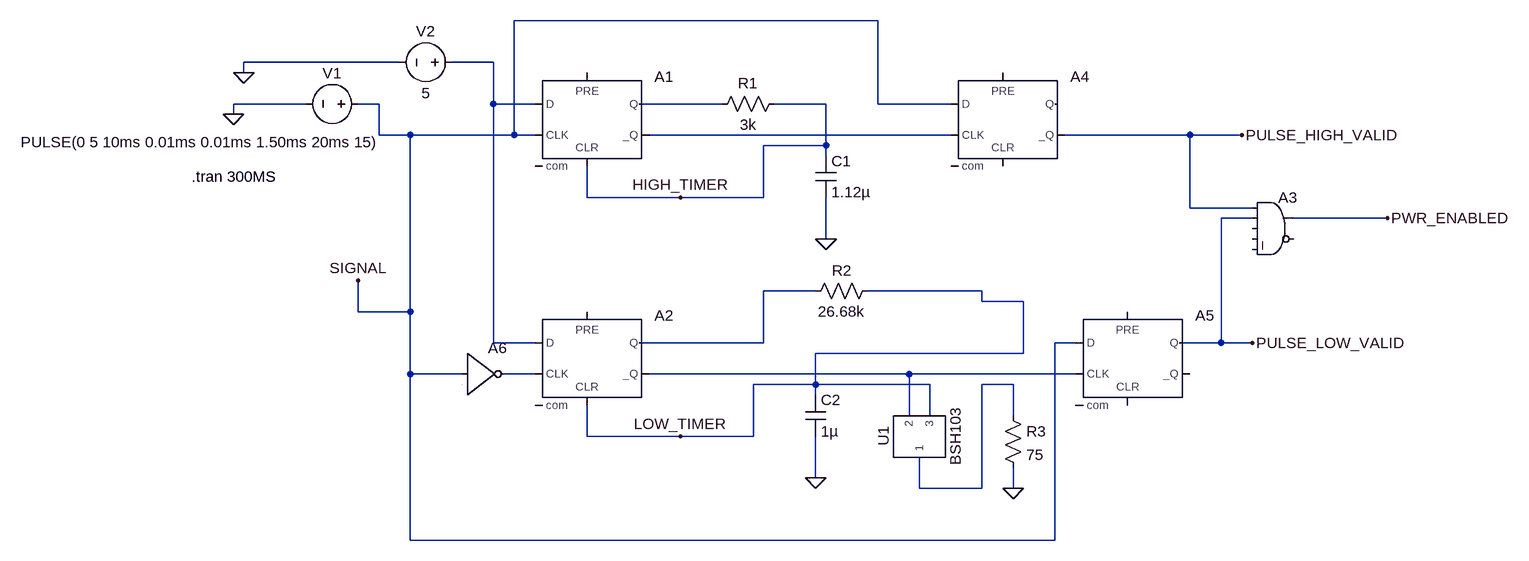
[diagram p0: schematic KillSwitch2.asc]
KillSwitch2.asc, the LTspice schematic file:
Version 4
SHEET 1 1240 956
WIRE 256 32 -304 32
WIRE -480 96 -720 96
WIRE -336 96 -400 96
WIRE -720 112 -720 96
WIRE -624 160 -736 160
WIRE -512 160 -544 160
WIRE -336 160 -336 96
WIRE -272 160 -336 160
WIRE 16 160 -112 160
WIRE 176 160 96 160
WIRE 256 160 256 32
WIRE 368 160 256 160
WIRE -736 176 -736 160
WIRE -512 208 -512 160
WIRE -464 208 -512 208
WIRE -304 208 -304 32
WIRE -304 208 -464 208
WIRE -272 208 -304 208
WIRE 368 208 -96 208
WIRE 736 208 544 208
WIRE 816 208 736 208
WIRE 176 224 176 160
WIRE 176 224 80 224
WIRE 176 240 176 224
WIRE -192 304 -192 256
WIRE -48 304 -192 304
WIRE 80 304 80 224
WIRE 80 304 -48 304
WIRE 736 320 736 208
WIRE 832 320 736 320
WIRE 832 336 784 336
WIRE 1040 336 896 336
WIRE 176 368 176 304
WIRE 160 448 80 448
WIRE 416 448 240 448
WIRE 416 464 416 448
WIRE 480 464 416 464
WIRE -544 480 -544 432
WIRE -464 480 -464 208
WIRE -464 480 -544 480
WIRE -336 528 -336 160
WIRE -272 528 -336 528
WIRE 80 528 80 448
WIRE 80 528 -112 528
WIRE 560 528 528 528
WIRE 784 528 784 336
WIRE 784 528 720 528
WIRE 832 528 784 528
WIRE 480 544 480 464
WIRE 480 544 160 544
WIRE -464 576 -464 480
WIRE -384 576 -464 576
WIRE -272 576 -320 576
WIRE 304 576 -96 576
WIRE 560 576 304 576
WIRE 160 592 160 544
WIRE 160 592 64 592
WIRE 336 592 160 592
WIRE 464 592 416 592
WIRE 160 608 160 592
WIRE 304 640 304 576
WIRE 336 640 336 592
WIRE 464 640 464 592
WIRE -192 672 -192 624
WIRE -48 672 -192 672
WIRE 64 672 64 592
WIRE 64 672 -48 672
WIRE 160 736 160 672
WIRE 320 752 320 704
WIRE 416 752 416 592
WIRE 416 752 320 752
WIRE 464 752 464 720
WIRE -464 832 -464 576
WIRE 528 832 528 528
WIRE 528 832 -464 832
FLAG 176 368 0
FLAG -736 176 0
FLAG 160 736 0
FLAG -720 112 0
FLAG 1040 336 PWR_ENABLED
FLAG 816 208 PULSE_HIGH_VALID
FLAG 832 528 PULSE_LOW_VALID
FLAG -544 432 SIGNAL
FLAG -48 304 HIGH_TIMER
FLAG -48 672 LOW_TIMER
FLAG 464 752 0
DATAFLAG 352 544 ""
SYMBOL Digital\\dflop -192 112 R0
SYMATTR InstName A1
SYMATTR SpiceLine Vhigh 5 Trise 10n
SYMBOL res 112 144 R90
WINDOW 0 0 56 VBottom 2
WINDOW 3 32 56 VTop 2
SYMATTR InstName R1
SYMATTR Value 3k
SYMBOL cap 160 240 R0
SYMATTR InstName C1
SYMATTR Value 1.12µ
SYMBOL Digital\\dflop -192 480 R0
SYMATTR InstName A2
SYMATTR SpiceLine Vhigh 5 Trise 10n
SYMBOL voltage -528 160 R90
WINDOW 0 -32 56 VBottom 2
WINDOW 3 43 259 VTop 2
WINDOW 123 0 0 Left 2
WINDOW 39 0 0 Left 2
SYMATTR InstName V1
SYMATTR Value PULSE(0 5 10ms 0.01ms 0.01ms 1.50ms 20ms 15)
SYMBOL voltage -384 96 R90
WINDOW 0 -32 56 VBottom 2
WINDOW 3 32 56 VTop 2
WINDOW 123 0 0 Left 2
WINDOW 39 0 0 Left 2
SYMATTR InstName V2
SYMATTR Value 5
SYMBOL res 256 432 R90
WINDOW 0 0 56 VBottom 2
WINDOW 3 32 56 VTop 2
SYMATTR InstName R2
SYMATTR Value 26.68k
SYMBOL cap 144 608 R0
SYMATTR InstName C2
SYMATTR Value 1µ
SYMBOL Digital\\dflop 448 112 R0
SYMATTR InstName A4
SYMATTR SpiceLine Vhigh 5 Trise 10n
SYMBOL Digital\\dflop 640 480 R0
SYMATTR InstName A5
SYMATTR SpiceLine Vhigh 5 Trise 10n
SYMBOL Digital\\inv -384 512 R0
SYMATTR InstName A6
SYMATTR SpiceLine VHigh = 5.0
SYMBOL Digital\\and 864 288 R0
SYMATTR InstName A3
SYMATTR SpiceLine Vhigh 4.5 Trise 10n
SYMBOL BSH103 320 672 R270
SYMATTR InstName U1
SYMBOL res 448 624 R0
SYMATTR InstName R3
SYMATTR Value 75
TEXT -800 272 Left 2 !.tran 300MS

The netlist it stands for:
* KillSwitch2.asc
A1 N001 0 SIGNAL 0 HIGH_TIMER N003 N002 0 DFLOP Vhigh 5 Trise 10n
R1 HIGH_TIMER N002 3k
C1 HIGH_TIMER 0 1.12µ
A2 N001 0 N005 0 LOW_TIMER N006 N004 0 DFLOP Vhigh 5 Trise 10n
V1 SIGNAL 0 PULSE(0 5 10ms 0.01ms 0.01ms 1.50ms 20ms 15)
V2 N001 0 5
R2 LOW_TIMER N004 26.68k
C2 LOW_TIMER 0 1µ
A4 SIGNAL 0 N003 0 0 PULSE_HIGH_VALID 0 0 DFLOP Vhigh 5 Trise 10n
A5 SIGNAL 0 N006 0 0 0 PULSE_LOW_VALID 0 DFLOP Vhigh 5 Trise 10n
A6 SIGNAL 0 0 0 0 N005 0 0 BUF VHigh = 5.0
A3 PULSE_HIGH_VALID PULSE_LOW_VALID 0 0 0 0 PWR_ENABLED 0 AND Vhigh 4.5 Trise 10n
XU1 N007 N006 LOW_TIMER BSH103  ; pins 1 2 3
R3 N007 0 75
.tran 300MS
.lib C:\Users\rites\Downloads\BSH103.prm
.backanno
.end

* Results of the author's LTspice run, read from the files saved beside the schematic
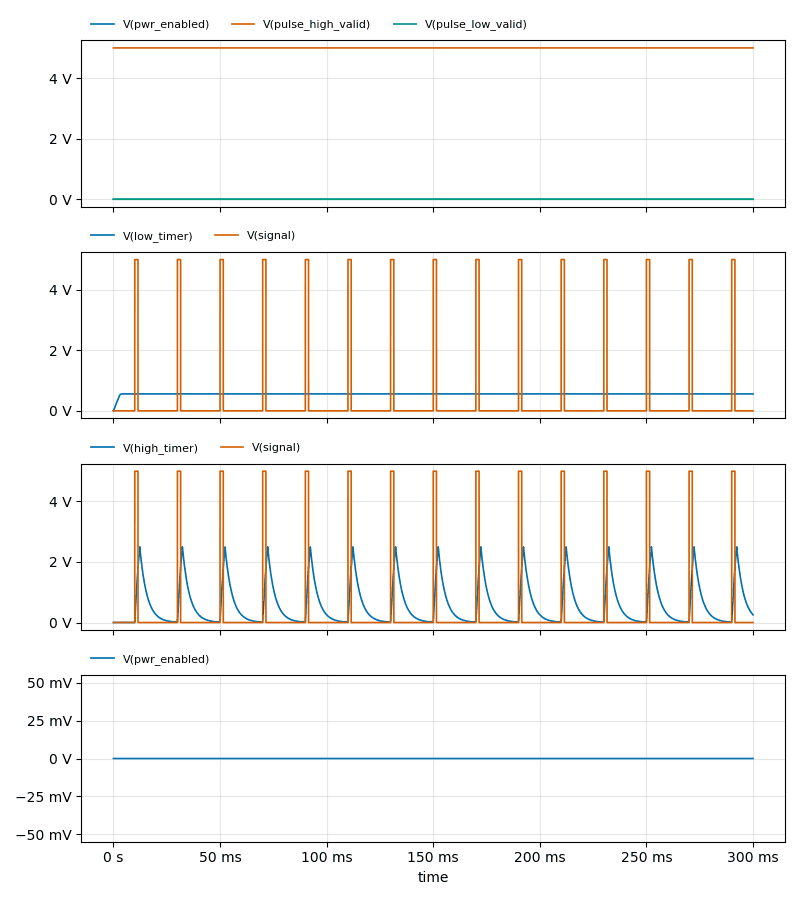
[diagram p1: Transient Analysis of KillSwitch2.asc, plotted from the saved traces]
* Transient Analysis, 1 run:
*   V(pwr_enabled): min 0 V, max 0 V, average 0 V, rms 0 V, last 0 V
*   V(pulse_high_valid): min 5 V, max 5 V, average 5 V, rms 5 V, last 5 V
*   V(pulse_low_valid): min 0 V, max 0 V, average 0 V, rms 0 V, last 0 V
*   V(low_timer): min -401.9 µV, max 560.4 mV, average 557.4 mV, rms 558.4 mV, last 560.4 mV
*   V(signal): min 0 V, max 5 V, average 377.5 mV, rms 1.372 V, last 0 V
*   V(high_timer): min 0 V, max 2.5 V, average 577.5 mV, rms 902.7 mV, last 254.3 mV
*   V(signal): min 0 V, max 5 V, average 377.5 mV, rms 1.372 V, last 0 V
*   V(pwr_enabled): min 0 V, max 0 V, average 0 V, rms 0 V, last 0 V